# Altium project 0.0 - Rail Gun.PrjPcb
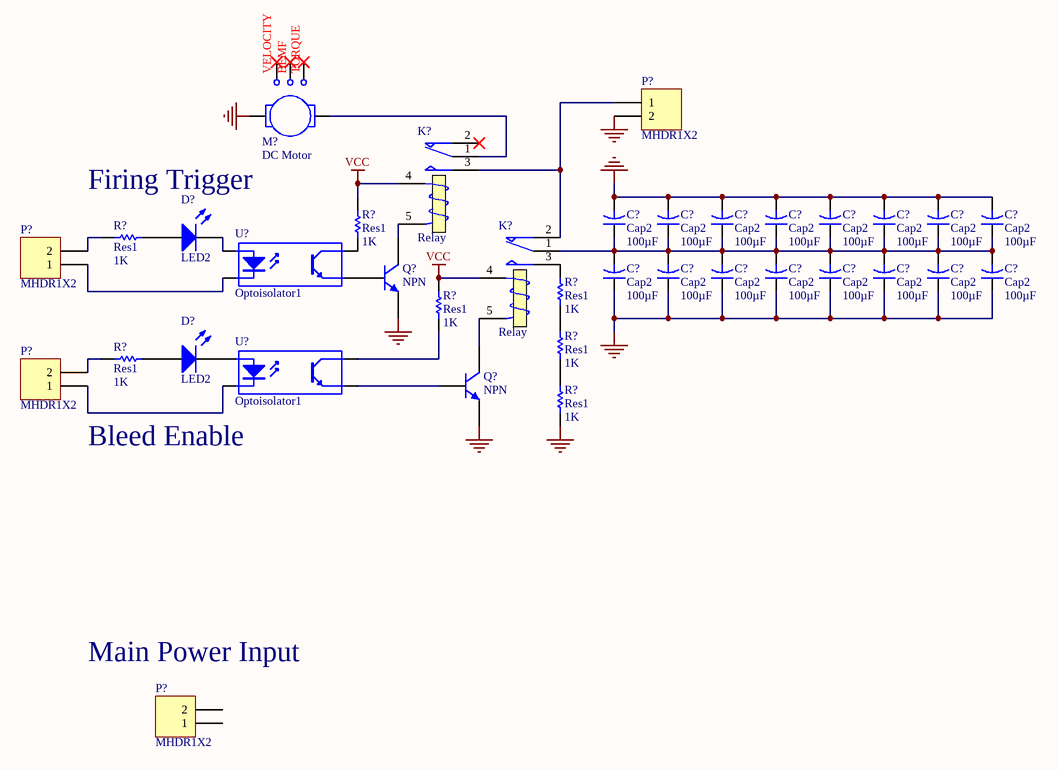
[diagram p0: Top.SchDoc]
1 sheet, 36 parts. Net scope: global (net labels, ports and power ports of the same name join across sheets).

## Sheet Top.SchDoc
size A4; SheetNumber: 1; SheetTotal: 1; SPICEModelCacheCLMKAPOG: <root> / <DocumentId>CLMKAPOG</DocumentId> / <CacheFrame Number="0"> / <Model Name="led2" Kind="MDL"> / <Text>*Typ RED,GREEN,YELLOW,AMBER GaAs LED: Vf=2.1V Vr=4V If=40mA trr=3uS / *LED Pinout: 1=A, 2=K / .MODEL LED2 D (IS=93.1P RS=42M N=4.61 BV=4 IBV=10U / + CJO=2.97P VJ=.75 M=.333 TT=4.32U)</Text> / </Model> / <Model Name="spdtrelay" Kind="CKT"> / <Text>*Generic SPDT Relay / *Connections:     COM / *                 | NC / *                 | | NO / *                 | | | T1 / *                 | | | | T2 / *                 | | | | | / .SUBCKT SPDTRELAY 1 2 3 4 5 / + PARAMS: PULLIN=4 DROPOFF=0.1 CONTACT=1m RESISTANCE=500 INDUCTANCE=10m / L1 4 6 {(INDUCTANCE/2)} / L2 5 7 {(INDUCTANCE/2)} / R1 6 7 {RESISTANCE} / BNO 8 0 V={PULLIN}-abs(v(6,7)) / SW1 2 1 8 0 SWNC ON / BNC 9 0 V=abs(v(6,7)) / SW2 3 1 9 0 SWNO OFF / .MODEL SWNC SW(VT={DROPOFF} RON={CONTACT} ) / .MODEL SWNO SW(VT={(PULLIN*0.98)} RON={CONTACT} ) / .ENDS SPDTRELAY</Text> / </Model> / <Model Name="npn" Kind="MDL"> / <Text>*Default NPN BJT / *NPN Trans Pinout: C,B,E / .MODEL NPN NPN()</Text> / </Model> / </CacheFrame> / </root>

### Parts
(Parts that share a designator on the sheet are numbered #1, #2 ... from top to bottom, then left to right.)
C?#1  Cap2  value 100µF  [CAPR5-4X5]
C?#2  Cap2  value 100µF  [CAPR5-4X5]
C?#3  Cap2  value 100µF  [CAPR5-4X5]
C?#4  Cap2  value 100µF  [CAPR5-4X5]
C?#5  Cap2  value 100µF  [CAPR5-4X5]
C?#6  Cap2  value 100µF  [CAPR5-4X5]
C?#7  Cap2  value 100µF  [CAPR5-4X5]
C?#8  Cap2  value 100µF  [CAPR5-4X5]
C?#9  Cap2  value 100µF  [CAPR5-4X5]
C?#10  Cap2  value 100µF  [CAPR5-4X5]
C?#11  Cap2  value 100µF  [CAPR5-4X5]
C?#12  Cap2  value 100µF  [CAPR5-4X5]
C?#13  Cap2  value 100µF  [CAPR5-4X5]
C?#14  Cap2  value 100µF  [CAPR5-4X5]
C?#15  Cap2  value 100µF  [CAPR5-4X5]
C?#16  Cap2  value 100µF  [CAPR5-4X5]
D?#1  LED2  [3.2X1.6X1.1]
D?#2  LED2  [3.2X1.6X1.1]
K?#1  Relay  [MODULE5B]
K?#2  Relay  [MODULE5B]
M?  DC Motor
P?#1  MHDR1X2  [MHDR1X2]
P?#2  MHDR1X2  [MHDR1X2]
P?#3  MHDR1X2  [MHDR1X2]
P?#4  MHDR1X2  [MHDR1X2]
Q?#1  NPN  [TO-226-AA]
Q?#2  NPN  [TO-226-AA]
R?#1  Res1  value 1K  [AXIAL-0.3]
R?#2  Res1  value 1K  [AXIAL-0.3]
R?#3  Res1  value 1K  [AXIAL-0.3]
R?#4  Res1  value 1K  [AXIAL-0.3]
R?#5  Res1  value 1K  [AXIAL-0.3]
R?#6  Res1  value 1K  [AXIAL-0.3]
R?#7  Res1  value 1K  [AXIAL-0.3]
U?#1  Optoisolator1  [DIP-4]
U?#2  Optoisolator1  [DIP-4]

### Nets
GND: C?#1.2 C?#2.2 C?#3.2 C?#4.2 C?#5.2 C?#6.2 C?#7.2 C?#8.2 C?#9.1 C?#10.1 C?#11.1 C?#12.1 C?#13.1 C?#14.1 C?#15.1 C?#16.1 M?.1 P?#1.2 Q?#1.3(E) Q?#2.3(E) R?#7.2
VCC: K?#1.4(T1) K?#2.4(T1) R?#2.2 R?#4.2
NetC?#1_1: C?#1.1 C?#2.1 C?#3.1 C?#4.1 C?#5.1 C?#6.1 C?#7.1 C?#8.1 C?#9.2 C?#10.2 C?#11.2 C?#12.2 C?#13.2 C?#14.2 C?#15.2 C?#16.2 K?#2.1(COM)
NetD?#1_1: D?#1.1(A) R?#1.2
NetD?#1_2: D?#1.2(K) U?#1.1(A)
NetD?#2_1: D?#2.1(A) R?#6.2
NetD?#2_2: D?#2.2(K) U?#2.1(A)
NetK?#1_1: K?#1.1(COM) M?.2
NetK?#1_3: K?#1.3(NO) K?#2.2(NC) P?#1.1
NetK?#1_5: K?#1.5(T2) Q?#1.1(C)
NetK?#2_3: K?#2.3(NO) R?#3.1
NetK?#2_5: K?#2.5(T2) Q?#2.1(C)
NetP?#2_1: P?#2.1 U?#1.2(K)
NetP?#2_2: P?#2.2 R?#1.1
NetP?#3_1: P?#3.1 U?#2.2(K)
NetP?#3_2: P?#3.2 R?#6.1
NetQ?#1_2: Q?#1.2(B) U?#1.3(E)
NetQ?#2_2: Q?#2.2(B) U?#2.3(E)
NetR?#2_1: R?#2.1 U?#1.4(C)
NetR?#3_2: R?#3.2 R?#5.1
NetR?#4_1: R?#4.1 U?#2.4(C)
NetR?#5_2: R?#5.2 R?#7.1

Not connected (* = marked no-connect by the designer): K?#1 2(NC)*; M? 3* 4* 5*; P?#4 1 2

### Notes on the sheet
- Firing Trigger
- Bleed Enable
- (near P?#4) Main Power Input
- (in symbol DC Motor) VELOCITY; BEMF; TORQUE

### Library data of the parts
C?#1-C?#16 = Cap2: Capacitor; Published: 23-Sep-2002; PackageReference: CAPR5-4X5; Publisher: Altium Limited; PackageDescription: Capacitor; 2 Leads
D?#1 D?#2 = LED2: Typical RED, GREEN, YELLOW, AMBER GaAs LED; Published: 8-Jun-2000; LatestRevisionDate: 17-Jul-2002; LatestRevisionNote: Re-released for DXP Platform.; PackageVersion: Feb-2002; PackageReference: 3.2X1.6X1.1; Publisher: Altium Limited; PackageDescription: SM LED; 2 Flat Leads
K?#1 K?#2 = Relay: SPDT Relay; Published: 8-Jun-2000; LatestRevisionDate: 17-Jul-2002; LatestRevisionNote: Re-released for DXP Platform.; PackageReference: MODULE5B; Publisher: Altium Limited
M? = DC Motor: LA: 1.5M; RA: 0.5; KE: 0.05; JM: 250U; BM: 0.1M; TL: 0; SimulationGenericComponent: True; KT: 0.05
P?#1-P?#4 = MHDR1X2: Header, 2-Pin; LatestRevisionDate: 17-Jul-2002; LatestRevisionNote: Re-released for DXP Platform.; Publisher: Altium Limited
Q?#1 Q?#2 = NPN: NPN Bipolar Transistor; Published: 8-Jun-2000; LatestRevisionDate: 17-Jul-2002; LatestRevisionNote: Re-released for DXP Platform.; PackageReference: TO-226-AA; Publisher: Altium Limited; PackageDescription: TO, Flat Index; 3 In-Line, Axial Leads; Body Dia. 4.8mm; Leads 0.55 x 0.51 mm (max); Code_JEDEC: TO-226-AA
R?#1-R?#7 = Res1: Resistor; Published: 8-Jun-2000; LatestRevisionDate: 17-Jul-2002; LatestRevisionNote: Re-released for DXP Platform.; PackageReference: AXIAL-0.3; Publisher: Altium Limited; PackageDescription: Axial Device, Thru-Hole; 2 Leads; 0.3 in Pin Spacing
U?#1 U?#2 = Optoisolator1: 4-Pin Phototransistor Optocoupler; Published: 24-Mar-1999; LatestRevisionDate: 04-Mar-2005; LatestRevisionNote: Sch pins 3 & 4 Swapped.; DatasheetVersion: Nov-2003; PackageReference: DIP-4; Publisher: Altium Limited